# Altium schematic sheet BUCK-BOOST.SchDoc
size A4; SheetNumber: 1; SheetTotal: 1
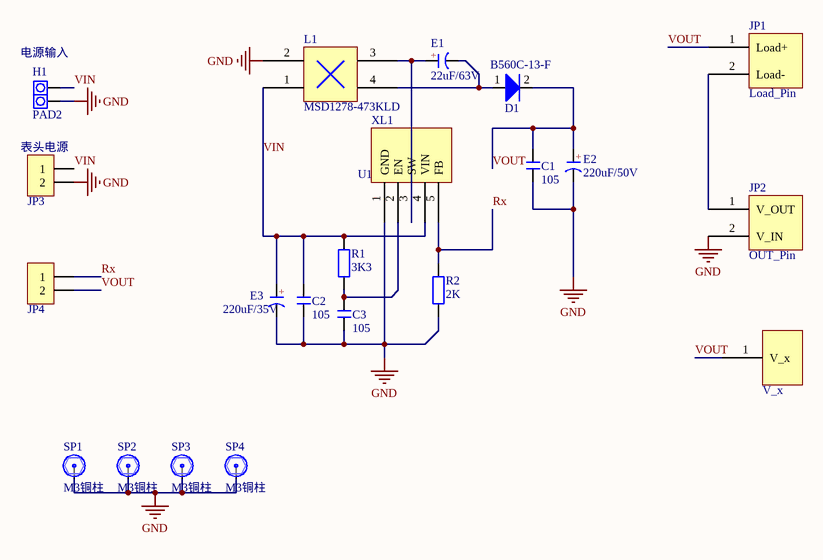
[diagram p0: BUCK-BOOST.SchDoc]

## Parts
*1  V_x  [PCBComponent_1 - duplicate]
C1  105  [C 0603_L]
C2  105  [C 0603_L]
C3  105  [C 0603_L]
D1  B560C-13-F  [DO-214AB]
E1  22uF/63V  [CAP 2.5*6.3*11.2]
E2  220uF/50V  [CAPAER_D100_L130_P055]
E3  220uF/35V  [CAPAER_D080_L125_P035]
H1  PAD2  [PAD2-5.08]
JP1  Load_Pin  [connect]
JP2  OUT_Pin  [connect]
JP3  HDR-1X2  [HDR2.54-LI-2P]  (value not drawn)
JP4  HDR-1X2  [HDR2.54-LI-2P]  (value not drawn)
L1  MSD1278-473KLD  [MSD-1278]
R1  3K3  [R 0603_L]
R2  2K  [R 0603_L]
SP1  M3铜柱  [M3x4+6_L]
SP2  M3铜柱  [M3x4+6_L]
SP3  M3铜柱  [M3x4+6_L]
SP4  M3铜柱  [M3x4+6_L]
XL1  U1  [T220-5]

## Nets
GND: C1.2 C2.2 C3.2 E2.2(K) E3.2(K) H1.1 JP2.2(V_IN) JP3.2 L1.2 R2.1 SP1.1 SP2.1 SP3.1 SP4.1 XL1.1(GND)
Rx: JP4.1 R2.2 XL1.5(FB)
VIN: C2.1 E3.1(A) H1.2 JP3.1 L1.1 R1.2 XL1.4(VIN)
VOUT: *1.1(V_x) C1.1 D1.2(K) E2.1(A) JP1.1(Load+) JP4.2
NetC3_1: C3.1 R1.1 XL1.2(EN)
NetD1_1: D1.1(A) E1.2(K) L1.4
NetE1_1: E1.1(A) L1.3 XL1.3(SW)
NetJP1_2: JP1.2(Load-) JP2.1(V_OUT)

## Notes on the sheet
- (near H1) 电源输入
- (near JP3) 表头电源
- (in symbol C-CAP) +

## Library data of the parts
C1-C3 = C: 无极性贴片电容; 版权归属: 源创客; BOM名称: 无极性贴片电容; 学习资源: www.ooocke.com
E1-E3 = C-CAP: 直插电解电容; 版权归属: 源创客; BOM名称: 直插电解电容; 学习资源: www.ooocke.com
H1 = PAD2: 引线焊盘; 版权归属: 源创客; BOM名称: 引线焊盘; 学习资源: www.ooocke.com
JP3 JP4 = Header 2: 2P接插件; 版权归属: 源创客; BOM名称: 2P接插件; 学习资源: www.ooocke.com
R1 R2 = R: 贴片电阻; 版权归属: 源创客; BOM名称: 贴片电阻; 学习资源: www.ooocke.com
SP1-SP4 = 铜柱加头小焊盘: 铜柱; 版权归属: 源创客; BOM名称: 铜柱; 学习资源: www.ooocke.com
XL1 = XL6012